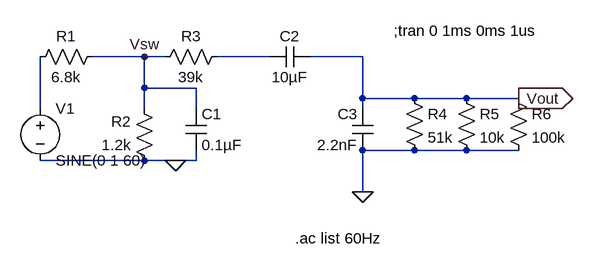
[diagram p0: schematic Draft1.asc]
Draft1.asc, the LTspice schematic file:
Version 4
SHEET 1 880 680
WIRE 176 0 96 0
WIRE 208 0 176 0
WIRE 368 0 288 0
WIRE 512 0 432 0
WIRE 176 48 176 0
WIRE 256 48 176 48
WIRE 512 64 512 0
WIRE 592 64 512 64
WIRE 672 64 592 64
WIRE 752 64 672 64
WIRE 16 80 16 0
WIRE 176 80 176 48
WIRE 256 80 256 48
WIRE 512 80 512 64
WIRE 592 144 512 144
WIRE 672 144 592 144
WIRE 752 144 672 144
WIRE 176 160 16 160
WIRE 224 160 176 160
WIRE 256 160 256 144
WIRE 256 160 224 160
WIRE 512 208 512 144
FLAG 224 160 0
FLAG 512 208 0
FLAG 752 64 Vout
IOPIN 752 64 Out
FLAG 176 0 Vsw
SYMBOL voltage 16 64 R0
WINDOW 39 0 0 Left 0
SYMATTR InstName V1
SYMATTR Value SINE(0 1 60)
SYMATTR Value2 AC 1 0
SYMBOL res 112 -16 R90
WINDOW 0 0 56 VBottom 2
WINDOW 3 32 56 VTop 2
SYMATTR InstName R1
SYMATTR Value 6.8k
SYMBOL res 192 176 R180
WINDOW 0 36 76 Left 2
WINDOW 3 36 40 Left 2
SYMATTR InstName R2
SYMATTR Value 1.2k
SYMBOL res 192 16 R270
WINDOW 0 32 56 VTop 2
WINDOW 3 0 56 VBottom 2
SYMATTR InstName R3
SYMATTR Value 39k
SYMBOL cap 240 80 R0
SYMATTR InstName C1
SYMATTR Value 0.1µF
SYMBOL cap 432 -16 R90
WINDOW 0 0 32 VBottom 2
WINDOW 3 32 32 VTop 2
SYMATTR InstName C2
SYMATTR Value 10µF
SYMBOL cap 528 144 R180
WINDOW 0 24 56 Left 2
WINDOW 3 24 8 Left 2
SYMATTR InstName C3
SYMATTR Value 2.2nF
SYMBOL res 576 48 R0
SYMATTR InstName R4
SYMATTR Value 51k
SYMBOL res 656 48 R0
SYMATTR InstName R5
SYMATTR Value 10k
SYMBOL res 736 48 R0
SYMATTR InstName R6
SYMATTR Value 100k
TEXT 408 280 Left 2 !.ac list 60Hz
TEXT 560 -40 Left 2 !;tran 0 1ms 0ms 1us

The netlist it stands for:
* Draft1.asc
V1 N002 0 SINE(0 1 60) AC 1 0
R1 Vsw N002 6.8k
R2 0 Vsw 1.2k
R3 Vsw N001 39k
C1 Vsw 0 0.1µF
C2 Vout N001 10µF
C3 0 Vout 2.2nF
R4 Vout 0 51k
R5 Vout 0 10k
R6 Vout 0 100k
.ac list 60Hz
;tran 0 1ms 0ms 1us
.backanno
.end